# EAGLE design arduino_Uno_RevG-MU (EAGLE 8.4.1)
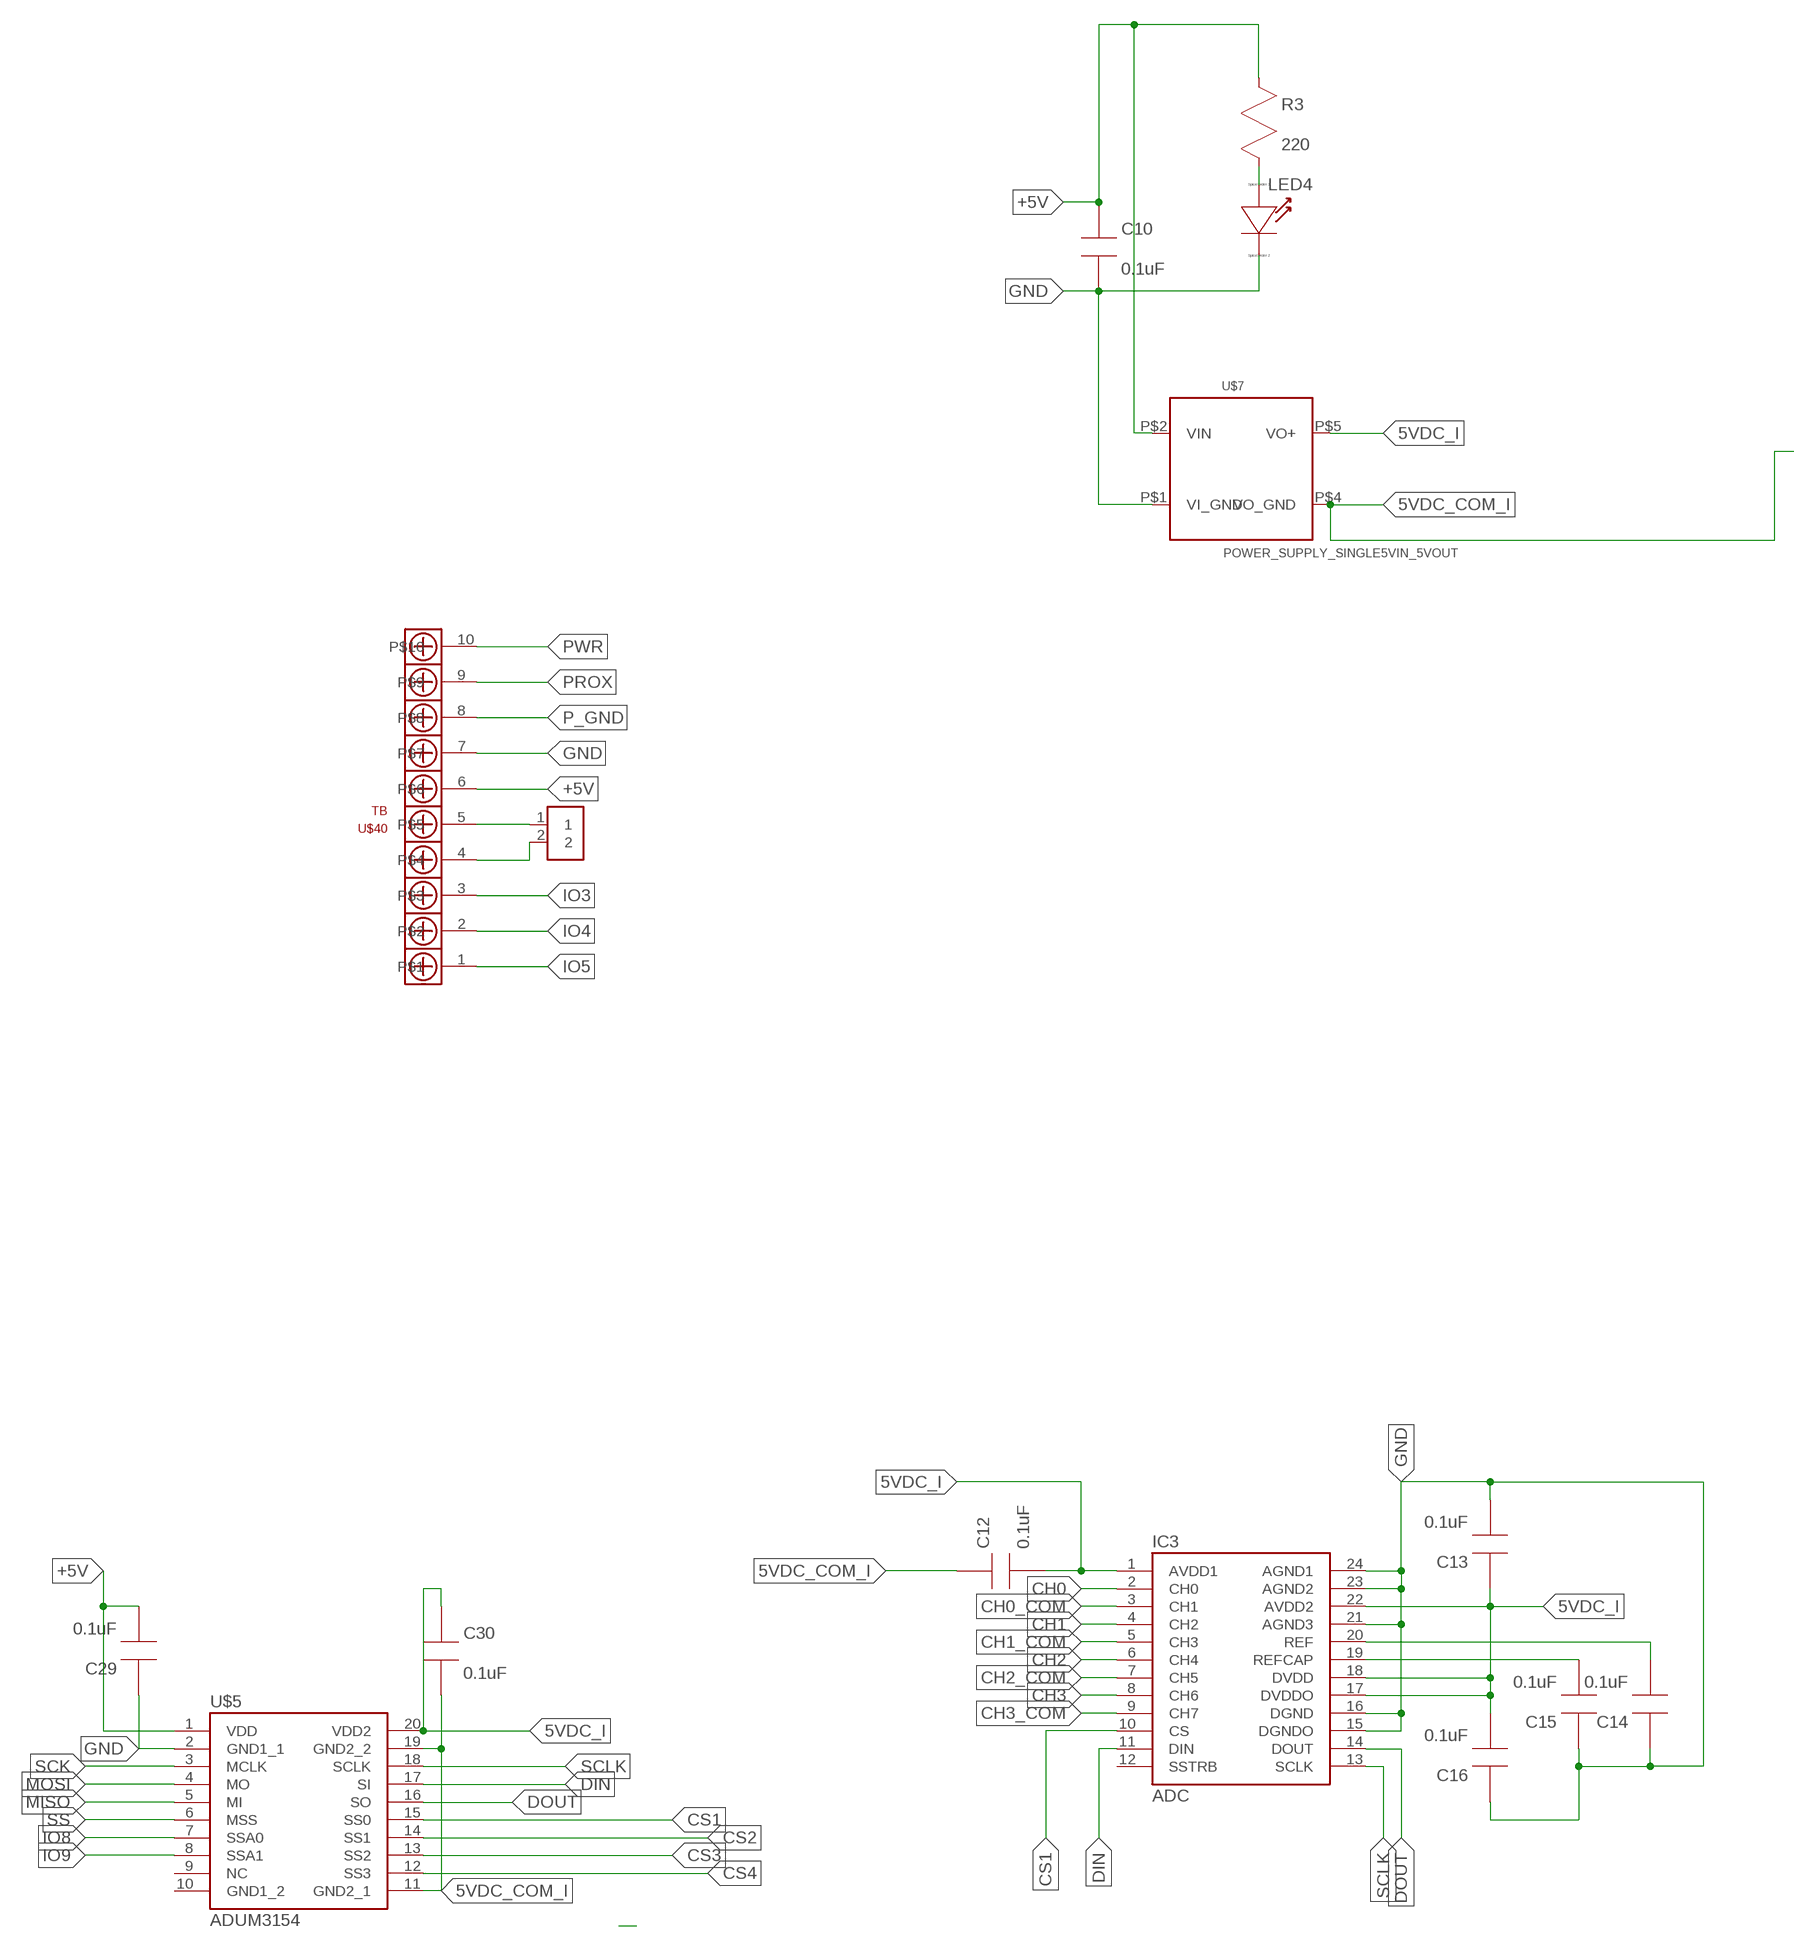
[diagram p0: schematic, sheet 1, part 1 of 2]
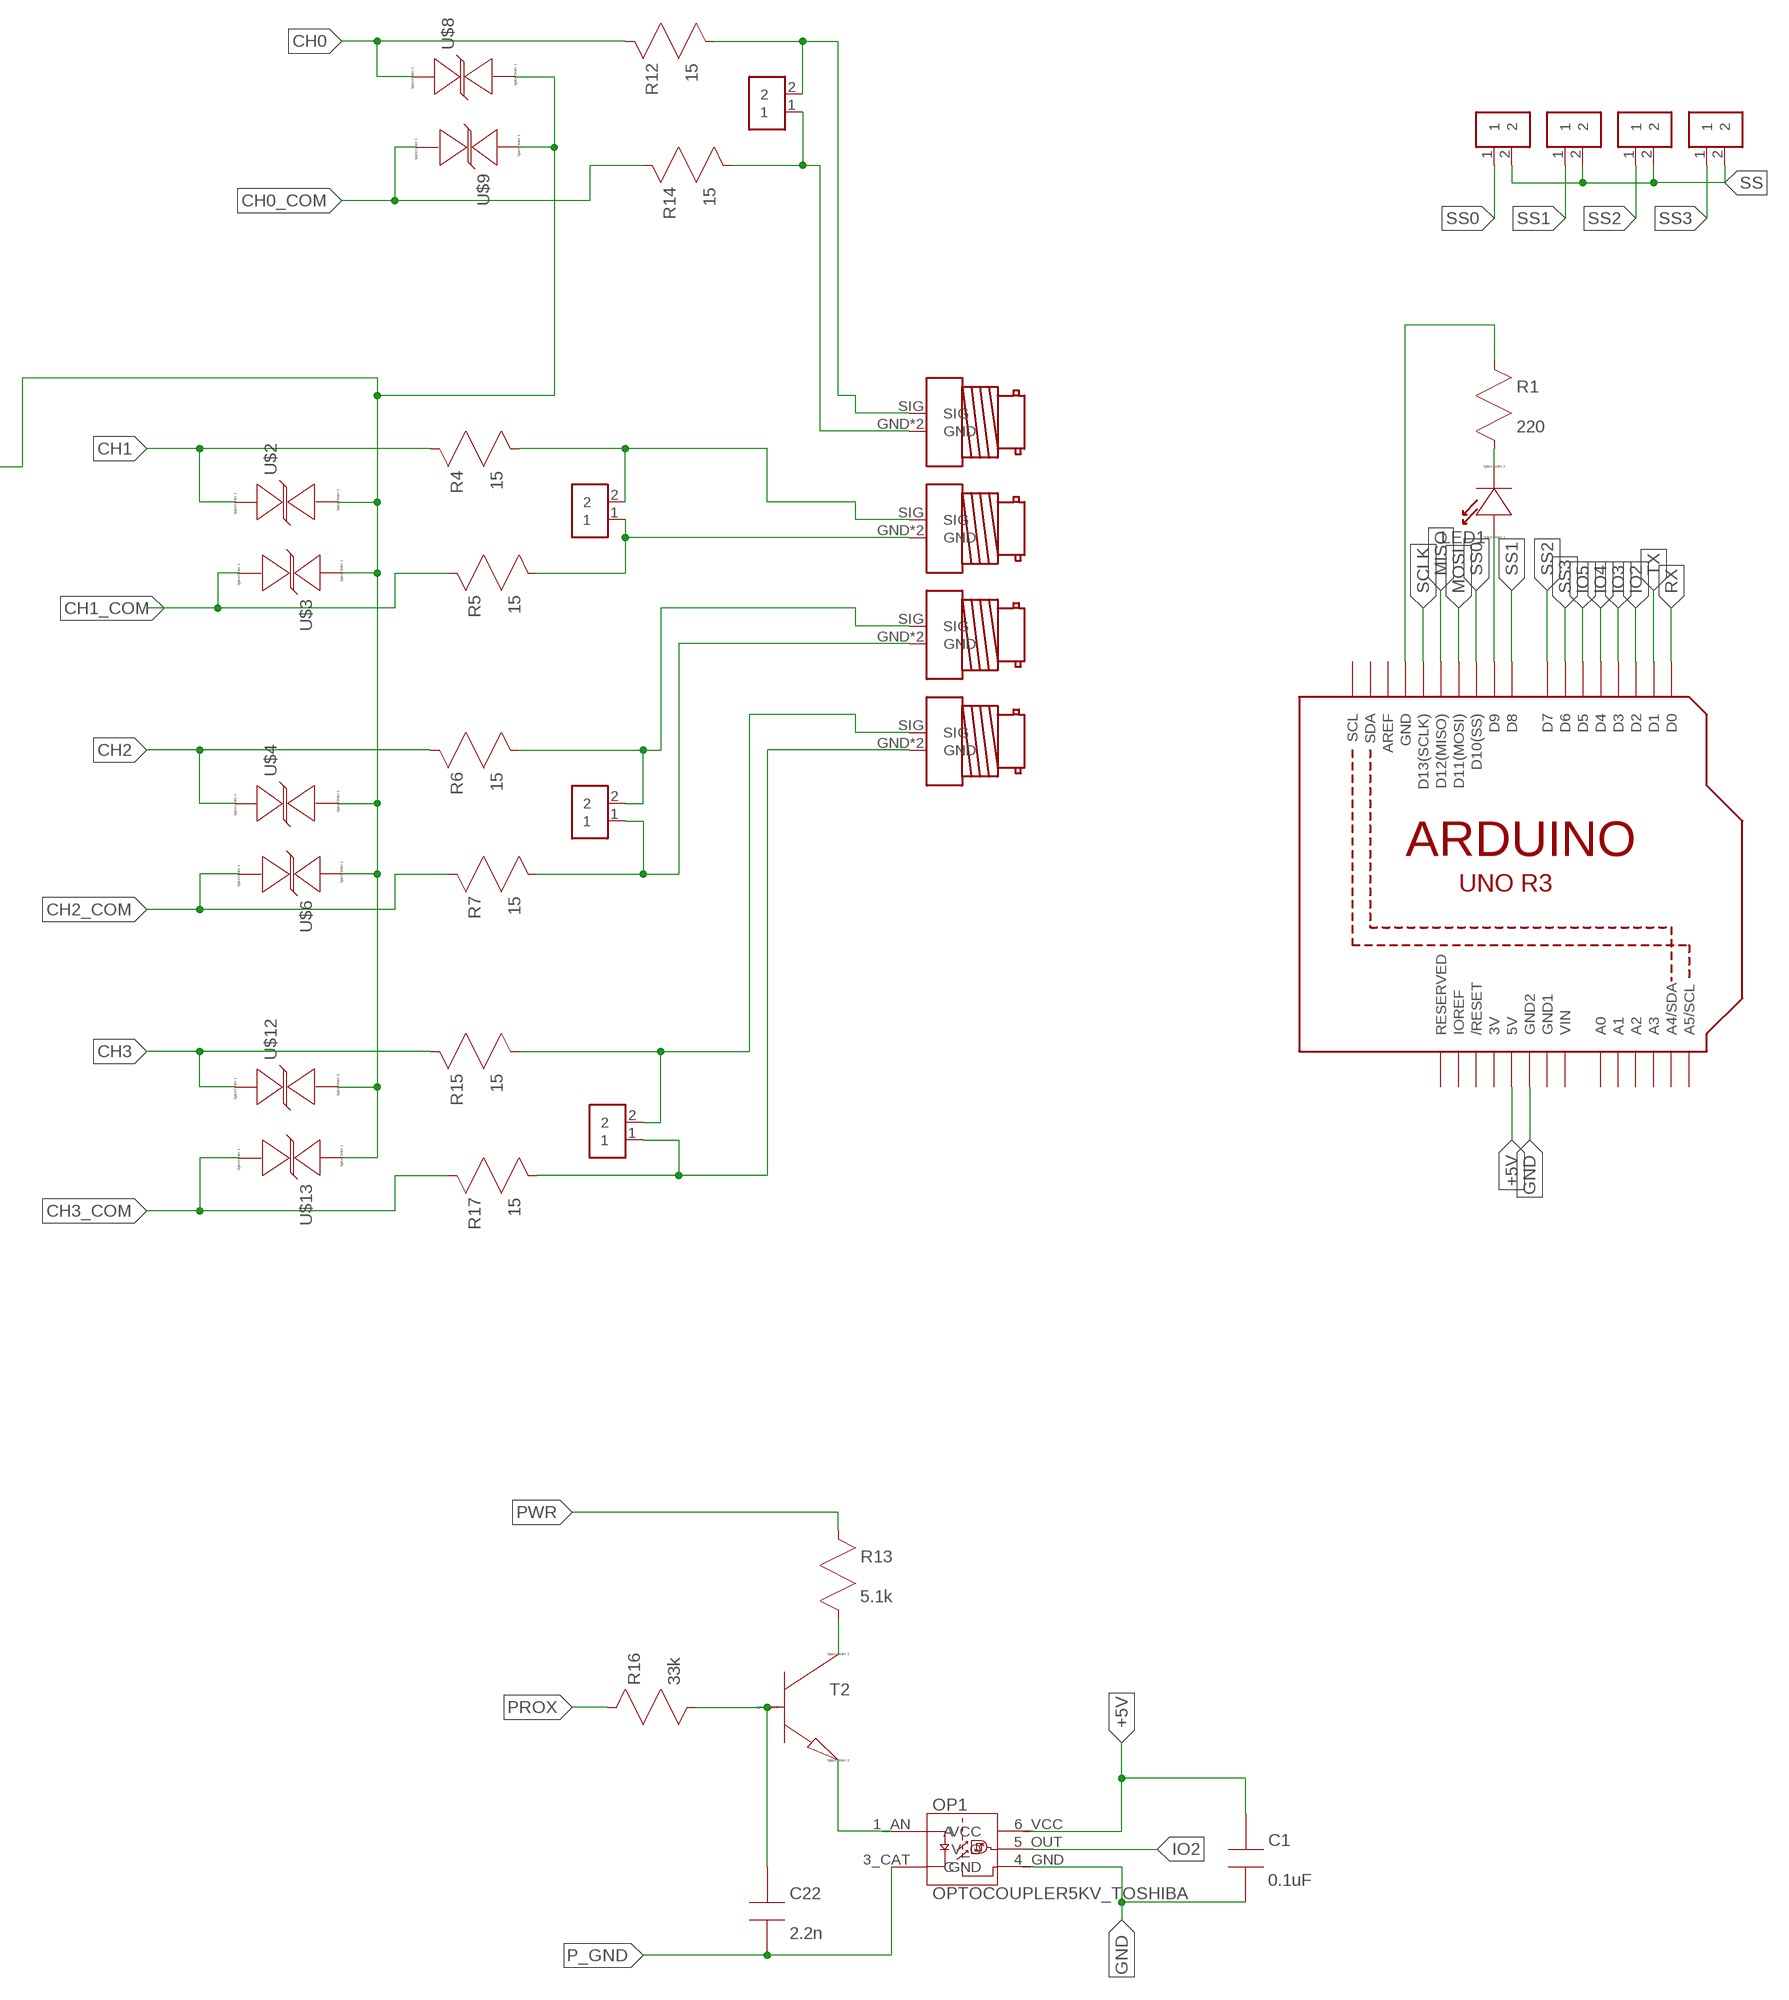
[diagram p1: schematic, sheet 1, part 2 of 2]

## Parts
C1  0.1uF  CAPACITOR0.1U_50V  [0805_SMD]
C10  0.1uF  CAPACITOR0.1U_50V  [0805_SMD]
C12  0.1uF  CAPACITOR0.1U_50V  [0805_SMD]
C13  0.1uF  CAPACITOR0.1U_50V  [0805_SMD]
C14  0.1uF  CAPACITOR0.1U_50V  [0805_SMD]
C15  0.1uF  CAPACITOR0.1U_50V  [0805_SMD]
C16  0.1uF  CAPACITOR0.1U_50V  [0805_SMD]
C22  2.2n  CAPACITOR2.2N_0805  [0805_SMD]
C29  0.1uF  CAPACITOR0.1U_50V  [0805_SMD]
C30  0.1uF  CAPACITOR0.1U_50V  [0805_SMD]
IC3  ADC  [LS_ELECTRIC_HTSSOP24-PAD]
LED1  LED0805_GREEN  [LED_0805]
LED4  LED0805_GREEN  [LED_0805]
OP1  OPTOCOUPLER5KV_TOSHIBA  [SO6L]
R1  220  RESISTOR220_0805  [0805_SMD]
R3  220  RESISTOR220_0805  [0805_SMD]
R4  15  RESISTOR15_0805  [0805_SMD]
R5  15  RESISTOR15_0805  [0805_SMD]
R6  15  RESISTOR15_0805  [0805_SMD]
R7  15  RESISTOR15_0805  [0805_SMD]
R12  15  RESISTOR15_0805  [0805_SMD]
R13  5.1k  RESISTOR5.1K_0805  [0805_SMD]
R14  15  RESISTOR15_0805  [0805_SMD]
R15  15  RESISTOR15_0805  [0805_SMD]
R16  33k  RESISTOR33K_0805  [0805_SMD]
R17  15  RESISTOR15_0805  [0805_SMD]
T2  TRANSISTOR_NPNMMBT3904L  [SOT23]
U4  ARDUINOR3-DIMENSION  [ARDUINOR3]
U$1  CH2  BNC_INVBNC_INVERT  [BNC]
U$2  TSV14VAC_18VDC  [0805_SMD]
U$3  TSV14VAC_18VDC  [0805_SMD]
U$4  TSV14VAC_18VDC  [0805_SMD]
U$5  ADUM3154  [SSOP_20]
U$6  TSV14VAC_18VDC  [0805_SMD]
U$7  POWER_SUPPLY_SINGLE5VIN_5VOUT  [SMT-R1SE-0505]
U$8  TSV14VAC_18VDC  [0805_SMD]
U$9  TSV14VAC_18VDC  [0805_SMD]
U$10  1X2_HEADER1X2  [1X2_HEADER]
U$11  1X2_HEADER1X2  [1X2_HEADER]
U$12  TSV14VAC_18VDC  [0805_SMD]
U$13  TSV14VAC_18VDC  [0805_SMD]
U$14  1X2_HEADER1X2  [1X2_HEADER]
U$15  1X2_HEADER1X2  [1X2_HEADER]
U$16  1X2_HEADER1X2  [1X2_HEADER]
U$17  1X2_HEADER1X2  [1X2_HEADER]
U$18  1X2_HEADER1X2  [1X2_HEADER]
U$19  1X2_HEADER1X2  [1X2_HEADER]
U$20  1X2_HEADER1X2  [1X2_HEADER]
U$34  CH1  BNC_INVBNC_INVERT  [BNC]
U$35  CH3  BNC_INVBNC_INVERT  [BNC]
U$36  CG4  BNC_INVBNC_INVERT  [BNC]
U$40  TB  TERMINAL_BLOCK_10PHOENIX_10  [TB_10P]

## Nets
5VDC_COM_I: C12.1(A) C30.2(B) U$2.2(GND) U$3.1(+) U$4.2(GND) U$5.11(GND2_1) U$5.19(GND2_2) U$6.1(+) U$7.P$4(VO_GND) U$8.2(GND) U$9.1(+) U$12.2(GND) U$13.1(+)
5VDC_I: C12.2(B) C13.1(A) C16.2(B) C30.1(A) IC3.1(AVDD1) IC3.17(DVDDO) IC3.18(DVDD) IC3.22(AVDD2) U$5.20(VDD2) U$7.P$5(VO+)
+5V [usbvcc]: C1.1(A) C10.1(A) C29.2(B) OP1.6_VCC(VCC) R3.1(A) U4.5V U$5.1(VDD) U$7.P$2(VIN) U$40.6
CH0: IC3.2(CH0) R12.1(A) U$8.1(+)
CH0_COM: IC3.3(CH1) R14.1(A) U$9.2(GND)
CH1: IC3.4(CH2) R4.1(A) U$2.1(+)
CH1_COM: IC3.5(CH3) R5.1(A) U$3.2(GND)
CH2: IC3.6(CH4) R6.1(A) U$4.1(+)
CH2_COM: IC3.7(CH5) R7.1(A) U$6.2(GND)
CH3: IC3.8(CH6) R15.1(A) U$12.1(+)
CH3_COM: IC3.9(CH7) R17.1(A) U$13.2(GND)
CS1: IC3.10(CS) U$5.15(SS0)
CS2: U$5.14(SS1)
CS3: U$5.13(SS2)
CS4: U$5.12(SS3)
DIN: IC3.11(DIN) U$5.17(SI)
DOUT: IC3.14(DOUT) U$5.16(SO)
GND [gnd]: C1.2(B) C10.2(B) C13.2(B) C14.1(A) C15.1(A) C16.1(A) C29.1(A) IC3.15(DGNDO) IC3.16(DGND) IC3.21(AGND3) IC3.23(AGND2) IC3.24(AGND1) LED4.C(-) OP1.4_GND(GND) R1.1(A) U4.GND U4.GND2 U$5.2(GND1_1) U$7.P$1(VI_GND) U$40.7
IO2: OP1.5_OUT(V_O) U4.D2
IO3: U4.D3 U$40.3
IO4: U4.D4 U$40.2
IO5: U4.D5 U$40.1
IO8: U$5.7(SSA0)
IO9: U$5.8(SSA1)
MISO: U4.D12(D12(MISO)) U$5.5(MI)
MOSI: U4.D11(D11(MOSI)) U$5.4(MO)
N$1: LED1.C(-) R1.2(B)
N$3: LED1.A(+) U4.D9
N$4: U$20.2 U$40.4
N$5: U$20.1 U$40.5
N$7: LED4.A(+) R3.2(B)
N$8: C14.2(B) IC3.20(REF)
N$9: C15.2(B) IC3.19(REFCAP)
N$10: R4.2(B) U$1.SIG U$11.2
N$11: R5.2(B) U$1.GND U$1.GND_INV(GND) U$11.1
N$12: R15.2(B) U$19.2 U$36.SIG
N$15: R17.2(B) U$19.1 U$36.GND U$36.GND_INV(GND)
N$18: OP1.1_AN(A) T2.2(E)
N$19: R13.2(B) T2.3(C)
N$20: C22.1(A) R16.2(B) T2.1(B)
N$22: R12.2(B) U$10.2 U$34.SIG
N$23: R14.2(B) U$10.1 U$34.GND U$34.GND_INV(GND)
N$33: R6.2(B) U$18.2 U$35.SIG
N$34: R7.2(B) U$18.1 U$35.GND U$35.GND_INV(GND)
P_GND: C22.2(B) OP1.3_CAT(C) U$40.8
PROX: R16.1(A) U$40.9
PWR: R13.1(A) U$40.10
RX: U4.D0
SCK: U$5.3(MCLK)
SCLK: IC3.13(SCLK) U4.D13(D13(SCLK)) U$5.18(SCLK)
SS: U$5.6(MSS) U$14.2 U$15.2 U$16.2 U$17.2
SS0: U4.D10(D10(SS)) U$14.1
SS1: U4.D8 U$15.1
SS2: U4.D7 U$16.1
SS3: U4.D6 U$17.1
TX: U4.D1
Unconnected: U4.A0 U4.A1 U4.A2 U4.A3 U4.A4(A4/SDA) U4.A5(A5/SCL) U4.AREF U4.IOREF U4.RESERVED U4.RESET(/RESET) U4.SCL U4.SDA U$5.9(NC) U$5.10(GND1_2)

## Power pins joined to a net without a drawn wire
3V: U4.3V
GND1: U4.GND1
SSTRB: IC3.12(SSTRB)
VIN: U4.VIN

## Library data of the parts
C1 C10 C12-C16 C29 C30 = LS_ELECTRIC:CAPACITOR: Capacitor (non polarity); DIGIKEY: 399-1176-1-ND; MPN: C0805C104M5UACTU
C22 = LS_ELECTRIC:CAPACITOR: Capacitor (non polarity); DIGIKEY: 399-1151-1-ND; MPN: C0805C222K5RACTU
IC3 = LS_ELECTRIC:ADC: 4/8 Channel 16bit ADC with 4 wire SPI; DIGIKEY: 700-MAX1300AEUG+; MPN: MAX1300AEUG+
LED1 LED4 = LS_ELECTRIC:LED: LED - 574nm Diffused; DIGIKEY: 160-1423-1-ND; MPN: LTST-C171GKT
OP1 = LS_ELECTRIC:OPTOCOUPLER: High Speed Optocoupler 5MBd 1Ch 1.6mA; DIGIKEY: TLP2745(TPECT-ND; MPN: TLP2745(TP,E
R1 R3 = LS_ELECTRIC:RESISTOR: Resistor 1MOhms; DIGIKEY: 311-220CRCT-ND; MPN: RC0805FR-07220RL
R4-R7 R12 R14 R15 R17 = LS_ELECTRIC:RESISTOR: Resistor 1MOhms; DIGIKEY: 311-15.0CRCT-ND; MPN: RC0805FR-0715RL
R13 = LS_ELECTRIC:RESISTOR: Resistor 1MOhms; DIGIKEY: 311-5.10KCRCT-ND; MPN: RC0805FR-075K1L
R16 = LS_ELECTRIC:RESISTOR: Resistor 1MOhms; DIGIKEY: 311-33.0KCRCT-ND; MPN: RC0805FR-0733KL
T2 = LS_ELECTRIC:TRANSISTOR_NPN: Bipolar Transistor - BJT NPN GENERAL PURPOSE; DIGIKEY: MMBT3904LT1GOSCT-ND; MPN: MMBT3904LT1G
U4 = LS_ELECTRIC:ARDUINOR3: This is a new object for the new Arduino R3 - with extra pins that you may want to use (such as IOref, and duplicated A4/A5
U$1 U$34-U$36 = LS_ELECTRIC:BNC_INV; MOUSER: 523-31-5431-10RFX; MPN: 031-5431-10RFX
U$2-U$4 U$6 U$8 U$9 U$12 U$13 = LS_ELECTRIC:TSV; DIGIKEY: 478-6867-1-ND; MPN: VCAS08LC18A500DP
U$5 = LS_ELECTRIC:ADUM3154; DIGIKEY: ADUM3154ARSZ-RL7CT-ND; MPN: ADUM3154ARSZ-RL7
U$7 = LS_ELECTRIC:POWER_SUPPLY_SINGLE: 1kV/1W - 5Vin/5Vout; DIGIKEY: 945-1659-1-ND; MPN: R1SE-0505-R
U$10 U$11 U$14-U$20 = LS_ELECTRIC:1X2_HEADER; DIGIKEY: WM4000-ND; MPN: 0022032021
U$40 = LS_ELECTRIC:TERMINAL_BLOCK_10; DIGIKEY_PLUG: 277-5742-ND; DIGIKEY_RECP: 277-5950-ND; MPN_PLUG: 1778069; MPN_RECP: 1776582

## Net classes
0 default: width 0.152 mm, clearance 0.152 mm
1 power: width 0.406 mm, drill 0.61 mm, clearance 0.152 mm
2 gnd: width 0.203 mm, drill 0.33 mm, clearance 0.432 mm
3 usbvcc: width 0.203 mm, drill 0.33 mm, clearance 0.152 mm
4 aref: width 0.203 mm, drill 0.61 mm, clearance 0.152 mm

## Board
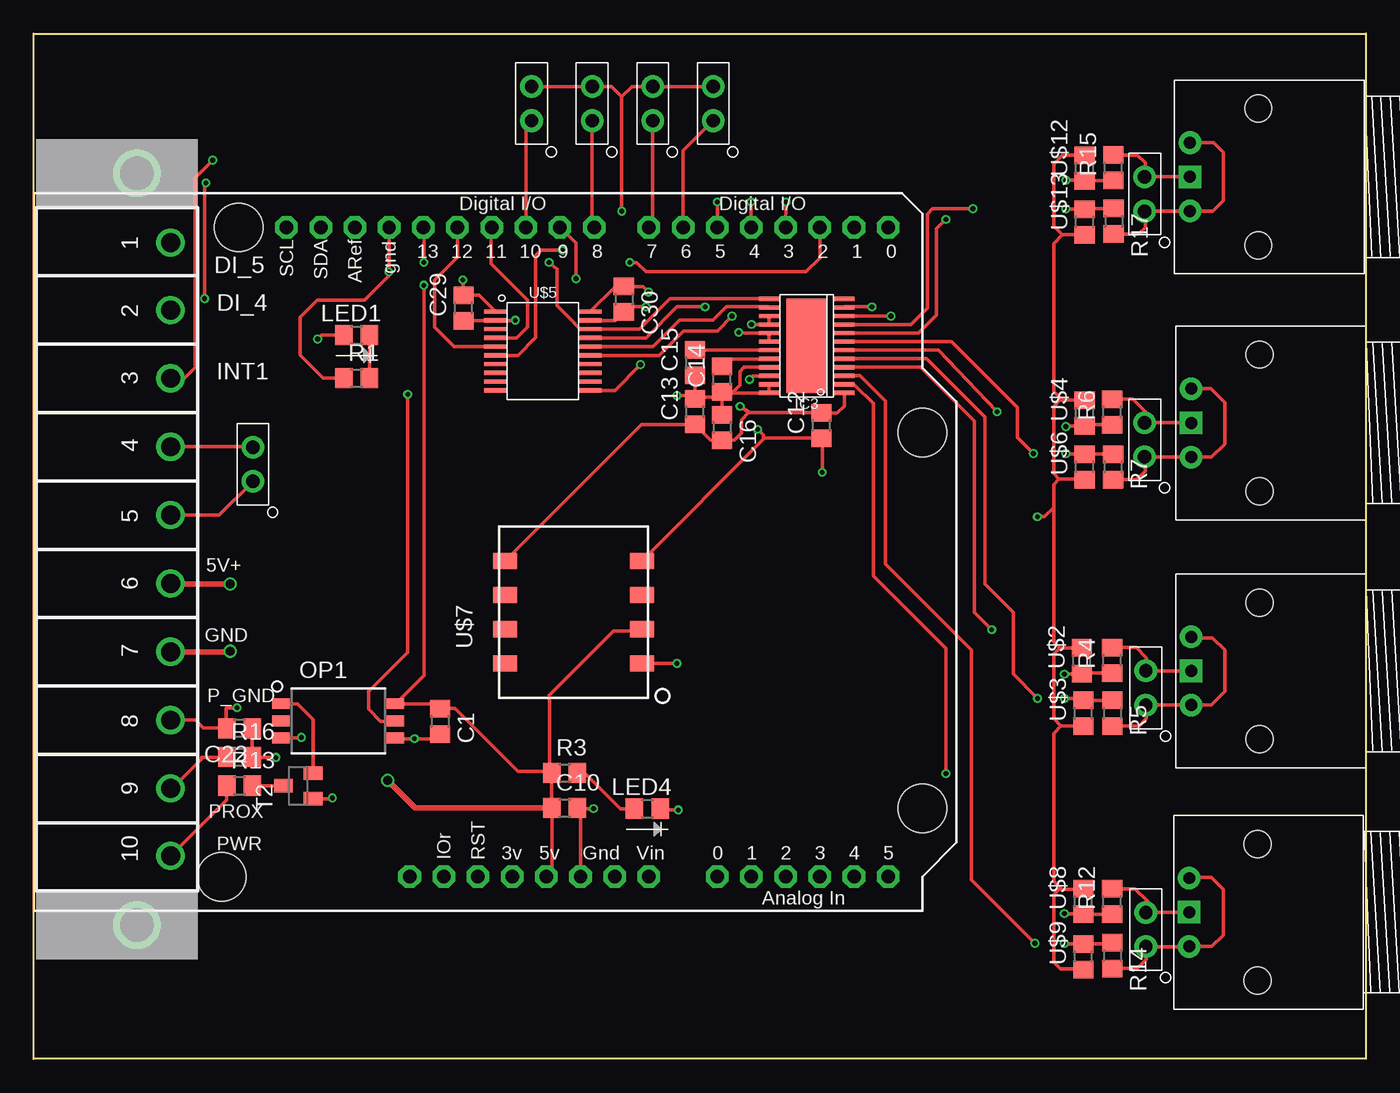
[diagram p2: board, top side]
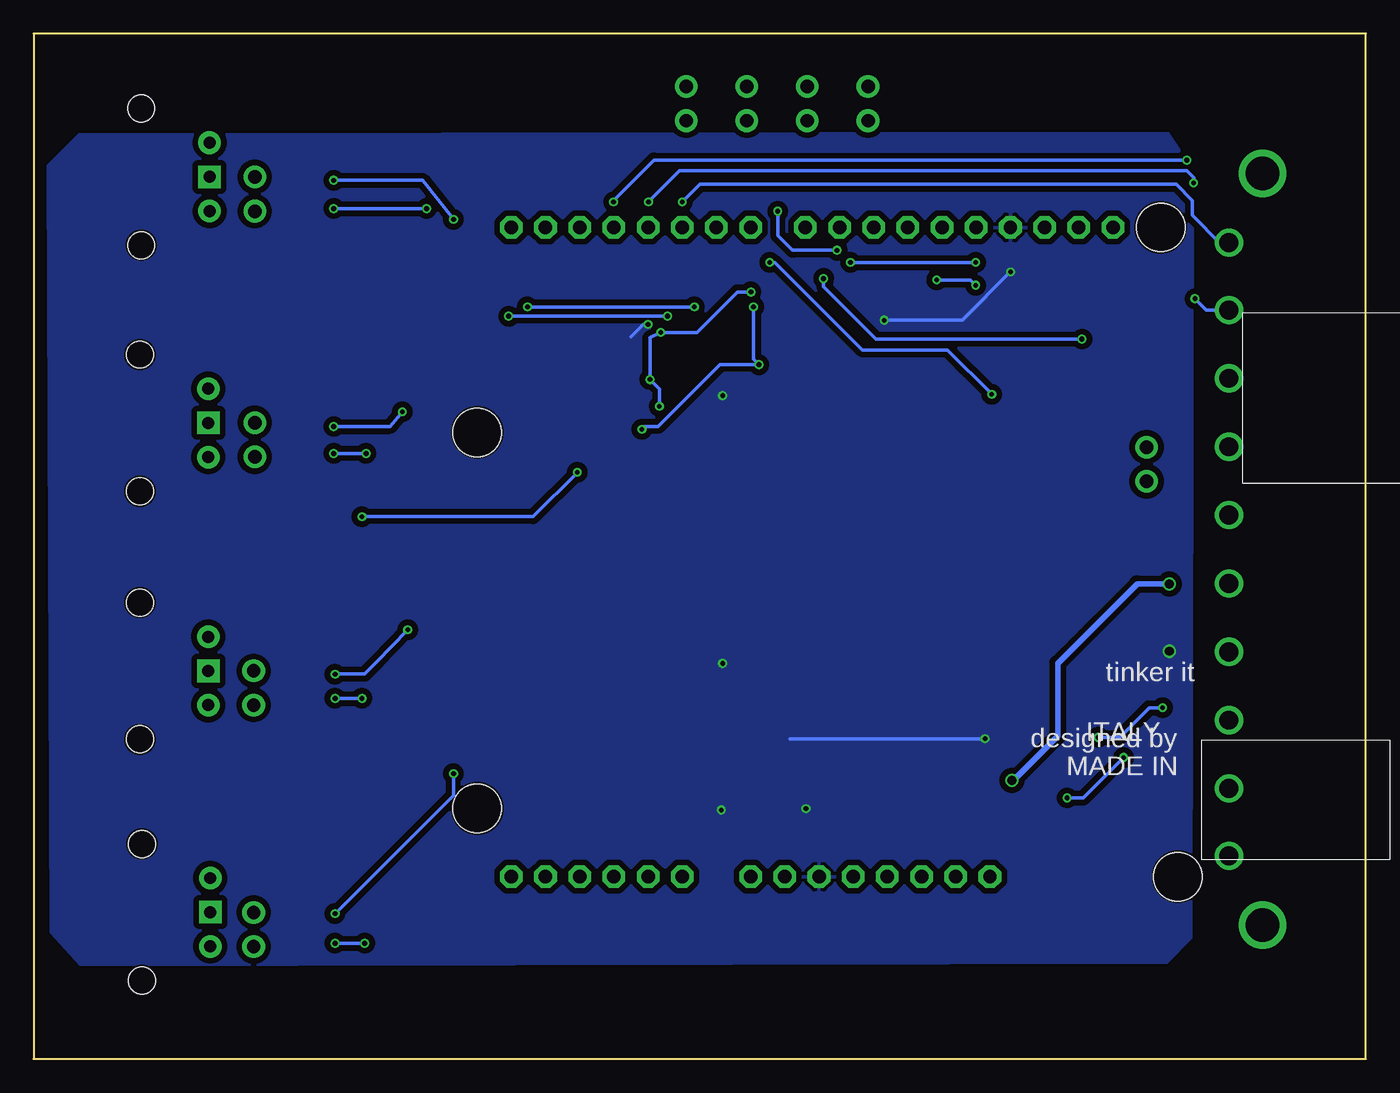
[diagram p3: board, bottom side, seen from below]

Size 99 x 76.2 mm. Coordinates in mm from the lower left corner, seen from the top.
Outline: 0,76.2 99,76.2 99,0 0,0 0,76.2
Copper layers (1*16): Top 0.035mm / dielectric 1.5mm / Bottom 0.035mm
Design rules "default *": minimum track width 6mil, minimum drill 10mil, track to track 6mil, track to pad 6mil, pad to pad 6mil, via to via 6mil, smd to smd 6mil, copper to edge 6mil, drill to drill 6mil, minimum pad ring 6mil, minimum via ring 6mil, stop-mask expansion 1mil, vias tented up to drill 0mil, thermal gap 10mil
vRestrict: area 22.9,44.1 to 24.6,49.1; area 25.4,45.5 to 27.1,49.1; area 28.4,45.3 to 29.6,48.8; area 31,45.3 to 32.1,48.8; area 33.5,45.3 to 34.7,48.8; area 36.1,45.3 to 37.2,48.8; area 38.7,47.2 to 39.9,48.8; area 40.3,45.1 to 47.6,46.9; area 60.3,44.2 to 61.7,46.7; area 62.9,44.2 to 64.3,46.7; area 61.3,35.8 to 64.8,37.2; area 0.6,21.8 to 2,30.1; 14 more areas

### Footprints (pad centres in the part's own frame; a part is rotated, then mirrored left to right if it is on the bottom)
0805_SMD = smd 1.3 x 1.5: 1 -0.95,0; 2 0.95,0
LS_ELECTRIC_HTSSOP24-PAD = smd 1.55 x 0.3: 1 -2.8,3.493; 2 -2.8,2.857; 3 -2.8,2.223; 4 -2.8,1.587; 5 -2.8,0.953; 6 -2.8,0.318; 7 -2.8,-0.318; 8 -2.8,-0.953; 9 -2.8,-1.587; 10 -2.8,-2.223; 11 -2.8,-2.857; 12 -2.8,-3.493; 13 2.8,-3.493; 14 2.8,-2.857; 15 2.8,-2.223; 16 2.8,-1.587; 17 2.8,-0.953; 18 2.8,-0.318; 19 2.8,0.318; 20 2.8,0.953; 21 2.8,1.587; 22 2.8,2.223; 23 2.8,2.857; 24 2.8,3.493 | smd 3 x 7: TP 0,0
LED_0805 = smd 1.3 x 1.5: A -0.95,0; C 0.95,0
SO6L = smd 1.3 x 0.8: 1_AN -4.25,1.27; 2_NC -4.25,0; 3_CAT -4.25,-1.27; 4_GND 4.25,-1.27; 5_OUT 4.25,0; 6_VCC 4.25,1.27
SOT23 = smd 1 x 1.4: 1 -0.95,-1.1; 2 0.95,-1.1; 3 0,1.1
ARDUINOR3 = drill 1 pad 1.676 octagon: 3V 35.56,2.54; 5V 38.1,2.54; A0 50.8,2.54; A1 53.34,2.54; A2 55.88,2.54; A3 58.42,2.54; A4 60.96,2.54; A5 63.5,2.54; AREF 23.876,50.8; D0 63.5,50.8; D1 60.96,50.8; D2 58.42,50.8; D3 55.88,50.8; D4 53.34,50.8; D5 50.8,50.8; D6 48.26,50.8; D7 45.72,50.8; D8 41.656,50.8; D9 39.116,50.8; D10 36.576,50.8; D11 34.036,50.8; D12 31.496,50.8; D13 28.956,50.8; GND 26.416,50.8; GND1 43.18,2.54; GND2 40.64,2.54; IOREF 30.48,2.54; RESERVED 27.94,2.54; RESET 33.02,2.54; SCL 18.796,50.8; SDA 21.336,50.8; VIN 45.72,2.54 | hole 3.6: 15.24,50.8; 13.97,2.54; 66.04,7.62; 66.04,35.56
BNC = drill 0.89 pad 1.676: GND -2.54,0; GND_INV 2.54,0 | drill 0.89 pad 1.676 square: SIG 0,0 | hole 2.01: -5.08,5.08; 5.08,5.08
SSOP_20 = smd 1.75 x 0.3: 1 -3.525,2.925; 2 -3.525,2.275; 3 -3.525,1.625; 4 -3.525,0.975; 5 -3.525,0.325; 6 -3.525,-0.325; 7 -3.525,-0.975; 8 -3.525,-1.625; 9 -3.525,-2.275; 10 -3.525,-2.925; 11 3.525,-2.925; 12 3.525,-2.275; 13 3.525,-1.625; 14 3.525,-0.975; 15 3.525,-0.325; 16 3.525,0.325; 17 3.525,0.975; 18 3.525,1.625; 19 3.525,2.275; 20 3.525,2.925
SMT-R1SE-0505 = smd 1.2 x 1.8: P$1 -3.81,-5.08; P$2 -1.27,-5.08; P$3 1.27,-5.08; P$4 3.81,-5.08; P$5 3.81,5.08; P$6 1.27,5.08; P$7 -1.27,5.08; P$8 -3.81,5.08
1X2_HEADER = drill 1 pad 1.676: 1 -1.27,0; 2 1.27,0
TB_10P = drill 1.4: 1 22.78,-4; 2 17.78,-4; 3 12.7,-4; 4 7.62,-4; 5 2.54,-4; 6 -2.54,-4; 7 -7.62,-4; 8 -12.7,-4; 9 -17.78,-4; 10 -22.78,-4 | drill 2.5: NC1 -27.94,-1.5; NC2 27.94,-1.5

### Placement (x,y rotation side)
C1  30.2,25.1 270 top
C10  39.46,18.66 0 top
C12  58.55,47.08 90 top
C13  49.15,48.1 90 top
C14  51.15,50.52 90 top
C15  49.15,51.74 90 top
C16  51.16,46.94 270 top
C22  15.3,24.57 180 top
C29  31.94,55.81 90 top
C30  43.86,56.47 270 top
IC3  57.44,52.99 180 top
LED1  24,53.8 0 top
LED4  45.6,18.6 0 top
OP1  22.64,25.13 0 top
R1  24,50.6 0 top
R3  39.45,21.26 0 top
R4  80.14,29.62 90 top
R5  80.16,25.7 270 top
R6  80.14,48.08 90 top
R7  80.21,44.01 270 top
R12  80.14,11.7 90 top
R13  15.29,20.31 0 top
R14  80.16,7.68 270 top
R15  80.24,66.23 90 top
R16  15.29,22.44 0 top
R17  80.26,62.26 270 top
T2  19.66,20.3 90 top
U4  0,11 0 top
U$1  86.03,28.84 270 top
U$2  77.9,29.6 90 top
U$3  78,25.7 90 top
U$4  78.1,48 90 top
U$5  37.84,52.62 0 top
U$6  78.1,44 90 top
U$7  40.12,33.21 90 top
U$8  78,11.7 90 top
U$9  78,7.6 90 top
U$10  82.65,9.62 90 top
U$11  82.65,27.57 90 top
U$12  78.1,66.2 90 top
U$13  78.1,62.2 90 top
U$14  37,71 90 top
U$15  41.5,71 90 top
U$16  46,71 90 top
U$17  50.5,71 90 top
U$18  82.57,46.02 90 top
U$19  82.57,64.28 90 top
U$20  16.3,44.2 90 top
U$34  85.88,10.9 270 top
U$35  86.03,47.27 270 top
U$36  85.92,65.56 270 top
U$40  6.17,37.88 90 top

### Tracks (layer width: path | path; a pad name or v marks a point on that pad's centre or on a via)
5VDC_COM_I  (via drill 0.35)
  Top 0.254: U$5.19 43.23,54.89 C30.2 44.24,55.9 v45.5,55.9 | 54.24,46.06 U$7.P$4 | 54.24,46.06 54.31,46.13 58.4,46.13 | 58.4,46.13 C12.1 | v45.1,51.6 43.19,49.69 U$5.11 | v53.8,46.8 54.24,46.36 54.24,46.06 | v58.6,43.6 58.6,45.93 58.4,46.13 | U$12.2 76.45,67.15 75.8,66.5 75.8,61.9 76.45,61.25 | U$13.1 76.45,61.25 | 76.45,61.25 75.8,60.6 75.8,49.6 76.45,48.95 | U$4.2 76.45,48.95 | 76.45,48.95 76.25,48.95 75.8,48.5 75.8,43.5 76.2,43.1 | 76.2,43.1 78.05,43.1 U$6.1 | 76.2,43.1 75.8,42.7 75.8,41 | U$2.2 76.25,30.55 | 75.8,41 75.8,31 76.25,30.55 | 76.25,30.55 75.8,30.1 75.8,25.3 76.35,24.75 | U$3.1 76.35,24.75 | 76.35,24.75 75.8,24.2 75.8,13.2 76.4,12.6 | 76.4,12.6 77.95,12.6 U$8.2 | 76.4,12.6 76.2,12.6 75.8,12.2 75.8,7.2 76.3,6.7 77.95,6.7 U$9.1 | v74.6,40.3 75.1,40.3 75.8,41
  Bottom 0.254: v45.5,55.9 45.5,52 v45.1,51.6 48,51.6 52.6,47 53.6,47 v53.8,46.8 | v58.6,43.6 61.9,40.3 v74.6,40.3
5VDC_I  (via drill 0.35)
  Top 0.254: 45.69,57.02 v45.7,57 45.28,57.41 C30.1 43.24,57.41 U$5.20 | v52.4,54 52.86,53.94 IC3.17 IC3.18 | 53.2,48.03 C12.2 58.58,48 59.7,48 60.24,48.54 IC3.1 | 53.2,48.03 53.13,48.03 52.6,47.5 52.6,46.5 52.09,45.99 C16.2 50.3,45.99 C13.1 45.17,47.15 U$7.P$5 | IC3.22 53.47,50.77 v53.2,50.5 | v52.5,48.5 53.2,48.03
  Bottom 0.254: v45.7,57 46.7,57 49.7,54 v52.4,54 53.2,53.6 v53.2,50.5 52.5,49.8 v52.5,48.5
+5V  (via drill 0.35, 0.65)
  Top 0.254: U$5.1 33.09,56.77 C29.2 31.9,56.8 v31.9,57.9 | U4.5V 38.51,13.95 C10.1 | U$7.P$2 45.06,31.8 43.1,31.8 38.3,27 38.33,26.39 38.33,21.44 38.38,21.38 | v29,57.5 29,28.51 OP1.6_VCC 29.85,26.4 C1.1 31.33,26.05 36,21.38 38.38,21.38 | 38.3,18.86 C10.1 | 38.38,21.38 R3.1 C10.1
  Top 0.406: C10.1 28.34,18.66 v26.3,20.7 | v14.6,35.3 10.21,35.3 U$40.6
  Bottom 0.254: v31.9,57.9 29.4,57.9 v29,57.5
  Bottom 0.406: v26.3,20.7 26.2,20.7 22.9,24 22.9,29.4 17,35.3 v14.6,35.3
CH0  (via drill 0.35)
  Top 0.254: R12.1 U$8.1 77.95,10.8 v76.6,10.8 | v67.8,21.2 67.8,30.5 62.4,35.9 62.4,48.7 60.97,50.13 IC3.2
  Bottom 0.254: v76.6,10.8 67.8,19.6 v67.8,21.2
CH0_COM  (via drill 0.35)
  Top 0.254: IC3.3 60.27,50.8 61.4,50.8 63.3,48.9 63.3,36.8 69.7,30.4 69.7,13.3 v74.4,8.6 | R14.1 80.08,8.55 U$9.2 76.65,8.55 v76.6,8.6
  Bottom 0.254: v76.6,8.6 v74.4,8.6
CH1  (via drill 0.35)
  Top 0.254: R4.1 77.92,28.67 U$2.1 77.85,28.6 v76.6,28.6 | v71.2,31.9 69.9,33.2 69.9,47.4 65.9,51.4 IC3.4
  Bottom 0.254: v76.6,28.6 74.4,28.6 73.5,29.5 v71.2,31.9
CH1_COM  (via drill 0.35)
  Top 0.254: IC3.5 66.36,52.04 70.7,47.7 70.7,35.3 72.8,33.2 72.8,28.6 v74.6,26.8 | R5.1 U$3.2 77.85,26.8 v76.6,26.8
  Bottom 0.254: v76.6,26.8 v74.6,26.8
CH2  (via drill 0.35)
  Top 0.254: R6.1 78.18,47.13 U$4.1 76.75,47.05 v76.7,47 | v71.6,48.1 67.23,52.67 IC3.6
  Bottom 0.254: v71.6,48.1 72.5,47 v76.7,47
CH2_COM  (via drill 0.35)
  Top 0.254: IC3.7 68.2,53.3 73.1,48.4 73.1,46.2 v74.3,45 | R7.1 U$6.2 76.75,44.95 v76.7,45
  Bottom 0.254: v74.3,45 v76.7,45
CH3  (via drill 0.35)
  Top 0.254: R15.1 78.13,65.28 U$12.1 78.05,65.3 v76.7,65.3 | v67.8,62.4 67.1,61.7 67.1,55.3 65.74,53.94 IC3.8
  Bottom 0.254: v76.7,65.3 70.1,65.3 v67.8,62.4
CH3_COM  (via drill 0.35)
  Top 0.254: R17.1 78.16,63.2 U$13.2 76.75,63.15 v76.7,63.2 | v69.8,63.2 66.8,63.2 66.4,62.8 66.4,55.8 65.18,54.58 IC3.9
  Bottom 0.254: v76.7,63.2 v69.8,63.2
CS1  (via drill 0.35)
  Top 0.254: U$5.15 46.49,52.29 48.3,54.1 50.8,54.1 v51.9,55.2 | v63.7,55.2 60.25,55.2 IC3.10
  Bottom 0.254: v51.9,55.2 v63.7,55.2
DIN  (via drill 0.35)
  Top 0.254: U$5.17 45.49,53.59 47.8,55.9 v49.89,55.9 v49.9,55.89 | v62.3,55.9 60.29,55.9 IC3.11
  Bottom 0.254: v49.9,55.89 v62.29,55.89 v62.3,55.9
DOUT
  Top 0.254: U$5.16 46.04,52.94 48,54.9 50.5,54.9 51.5,55.9 54.59,55.9 IC3.14
GND  (via drill 0.35, 0.65)
  Top 0.254: C29.1 31.96,54.89 U$5.2 v35.79,54.89 v35.8,54.9 | IC3.23 IC3.24 51.9,49.5 | C14.1 51.15,47.9 C16.1 | 49.15,49.2 C15.1 | 49.15,49.2 C13.2 48.9,49.3 v47.8,49.3 | C14.1 50.77,49.2 49.15,49.2 | 51.9,49.5 51.22,49.5 C14.1 | IC3.21 52.8,51.4 52.5,51.1 52.5,50.1 51.9,49.5 | IC3.15 IC3.16 53.36,54.58 v53.35,54.59 | 40.49,18.57 C10.2 | C10.2 40.64,18.43 U4.GND2 | OP1.4_GND 26.95,23.8 v28.3,23.8 29.85,23.8 C1.2 | C10.2 40.47,18.6 v41.6,18.6 | LED4.C 46.65,18.5 v47.9,18.5 | U4.GND 26.42,58.52 v26.4,58.5 26.4,58.2 24.6,56.4 21.07,56.4 19.8,55.12 19.8,52.3 21.5,50.6 R1.1 | U$7.P$1 v47.8,29.4
  Top 0.406: U$40.7 14.56,30.26 v14.6,30.3
  Bottom 0.254: v28.3,23.8 42.8,23.8 | v35.8,54.9 30,54.9 v26.4,58.5 | v53.35,54.59 53.71,54.59 54.6,53.7
  pour Bottom: 95.6,68.7 97.9,66.4 97.7,9.4 95.5,7 14.8,7.2 13,9 12.9,66.1 14.7,68.8
IO2  (via drill 0.35)
  Top 0.254: OP1.5_OUT 26.86,25.1 25.8,25.1 24.9,26 24.9,27.3 27.8,30.2 v27.8,49.4 | v44.3,59.2 44.8,59.2 45.5,58.5 57.4,58.5 58.42,59.52 U4.D2
  Bottom 0.254: v27.8,49.4 31.1,52.7 37.4,52.7 43.9,59.2 v44.3,59.2
IO3  (via drill 0.35)
  Top 0.254: U$40.3 11.18,50.58 12,51.4 12,65.5 v13.3,66.8 | U4.D3 v55.9,63.7
  Bottom 0.254: v55.9,63.7 55.9,63.8 52.9,66.8 v13.3,66.8
IO4  (via drill 0.35)
  Top 0.254: U4.D4 53.3,61.84 v53.3,63.7 | v12.8,65.1 12.7,65 v12.7,56.5
  Bottom 0.254: v53.3,63.7 51,66 13.3,66 12.8,65.5 v12.8,65.1 | v12.7,56.5 11.86,55.66 U$40.2
IO5  (via drill 0.35)
  Top 0.254: U4.D5 v50.8,63.7
  Bottom 0.254: v50.8,63.7 49.5,65 14.1,65 12.9,63.8 12.9,62.7 10.8,60.6 10.23,60.6 U$40.1
MISO
  Top 0.254: U$5.5 31.26,52.94 29.8,54.4 29.8,57.9 31.5,59.6 U4.D12
MOSI
  Top 0.254: U$5.4 35.89,53.59 36.7,54.4 36.7,56.4 34,59.1 34,61.76 U4.D11
N$1
  Top 0.254: LED1.C R1.2
N$3  (via drill 0.35)
  Top 0.254: U4.D9 40.3,60.62 v40.3,58 | v21.1,53.5 21.4,53.8 LED1.A
  Bottom 0.254: v40.3,58 40.3,57.4 36.4,53.5 v21.1,53.5
N$4
  Top 0.254: U$40.4 16.27,45.5 U$20.2
N$5
  Top 0.254: U$20.1 13.79,40.42 U$40.5
N$7
  Top 0.254: LED4.A 43.6,18.6 40.94,21.26 R3.2
N$8
  Top 0.254: IC3.20 54.6,52 51.67,52 C14.2
N$9
  Top 0.254: IC3.19 54.62,52.69 C15.2
N$10
  Top 0.254: R4.2 81.93,30.57 82.7,29.8 82.7,28.89 | 82.7,28.89 U$11.2 | U$1.SIG 82.76,28.84 82.7,28.89
N$11
  Top 0.254: R5.2 82.15,24.75 82.7,25.3 82.7,26.1 | 82.7,26.1 82.7,26.25 82.74,26.3 U$1.GND_INV 87.5,26.3 88.5,27.3 88.5,30.4 87.6,31.3 86.1,31.3 U$1.GND | U$11.1 82.65,26.15 82.7,26.1
N$12
  Top 0.254: U$36.SIG U$19.2 82.6,65.58 82.6,66.6 82.02,67.18 R15.2
N$15
  Top 0.254: U$19.1 | R17.2 82.11,61.3 82.6,61.8 82.6,62.98 U$19.1 | U$19.1 85.92,63.01 U$36.GND_INV 87.61,63.02 88.4,63.8 88.4,67.4 87.7,68.1 U$36.GND
N$18
  Top 0.254: OP1.1_AN 19.6,26.4 20.76,25.24 T2.2
N$19
  Top 0.254: R13.2 16.26,20.3 T2.3
N$20  (via drill 0.35)
  Top 0.254: C22.1 R16.2 16.29,22.4 v18,22.4 | T2.1 22.14,19.34 v22.2,19.4
  Bottom 0.254: v22.2,19.4 21,19.4 v18,22.4
N$22
  Top 0.254: U$34.SIG 85.86,10.88 82.8,10.88 | 82.8,10.88 U$10.2 | R12.2 81.85,12.65 82.8,11.7 82.8,10.88
N$23
  Top 0.254: R14.2 82.03,6.74 82.7,7.4 82.7,8.29 U$10.1 85.86,8.35 U$34.GND_INV 87.56,8.36 88.4,9.2 88.4,12.6 87.5,13.5 85.94,13.5 U$34.GND
N$33
  Top 0.254: U$35.SIG 86.01,47.28 82.6,47.28 | 82.6,47.28 U$18.2 | R6.2 81.67,49.03 82.6,48.1 82.6,47.28
N$34
  Top 0.254: R7.2 81.95,43.05 82.6,43.7 82.6,44.72 U$18.1 86.01,44.74 U$35.GND_INV 87.53,44.73 88.5,45.7 88.5,48.8 87.49,49.81 U$35.GND
P_GND  (via drill 0.35)
  Top 0.254: OP1.3_CAT 19.86,23.86 v19.9,23.9 | v15.1,26.1 14.3,26.1 14.3,24.63 C22.2 14.33,24.6 12.6,24.6 12.02,25.18 U$40.8
  Bottom 0.254: v19.9,23.9 18.3,23.9 16.1,26.1 v15.1,26.1
PROX
  Top 0.254: 12.6,22.4 12.5,22.4 | 12.6,22.4 14.3,22.4 R16.1 | U$40.9 10.3,20.1 12.6,22.4
PWR
  Top 0.254: U$40.10 14.35,19.27 R13.1
SCLK  (via drill 0.35)
  Top 0.254: v38.3,59.2 38.9,58.7 38.9,56 40.21,54.69 40.21,54.64 40.61,54.24 U$5.18 45.04,54.24 47.3,56.5 54.62,56.5 IC3.13 | v29,59.2 29,61.76 U4.D13
  Bottom 0.254: v38.3,59.2 v29,59.2
SS  (via drill 0.35)
  Top 0.254: U$5.6 35.99,52.29 37.3,53.6 37.3,59.7 37.7,60.1 v39.3,60.1 | v43.7,63 43.7,71.5 | 43.7,71.5 42.9,72.3 42.87,72.27 U$15.2 U$14.2 | 43.7,71.5 44.47,72.27 U$16.2 U$17.2
  Bottom 0.254: v39.3,60.1 42.6,60.1 43.7,61.2 v43.7,63
SS0
  Top 0.254: U$14.1 36.58,69.31 U4.D10
SS1
  Top 0.254: U$15.1 41.5,61.96 U4.D8
SS2
  Top 0.254: U$16.1 46,62.08 U4.D7
SS3
  Top 0.254: U$17.1 48.26,67.49 U4.D6

### Text on the board
tPlace: DI_5 | DI_4 | INT1 | 5V+ | GND | P_GND | PROX | PWR
bNames: tinker it | designed by | ITALY | MADE IN
ReferenceLC: L | TX | RX | PC1 | PC2
214bmp: D:/SmartProjects/Snc/a4_bn_logo2.bmp